# Altium schematic sheet PowerAmp.SchDoc
size A
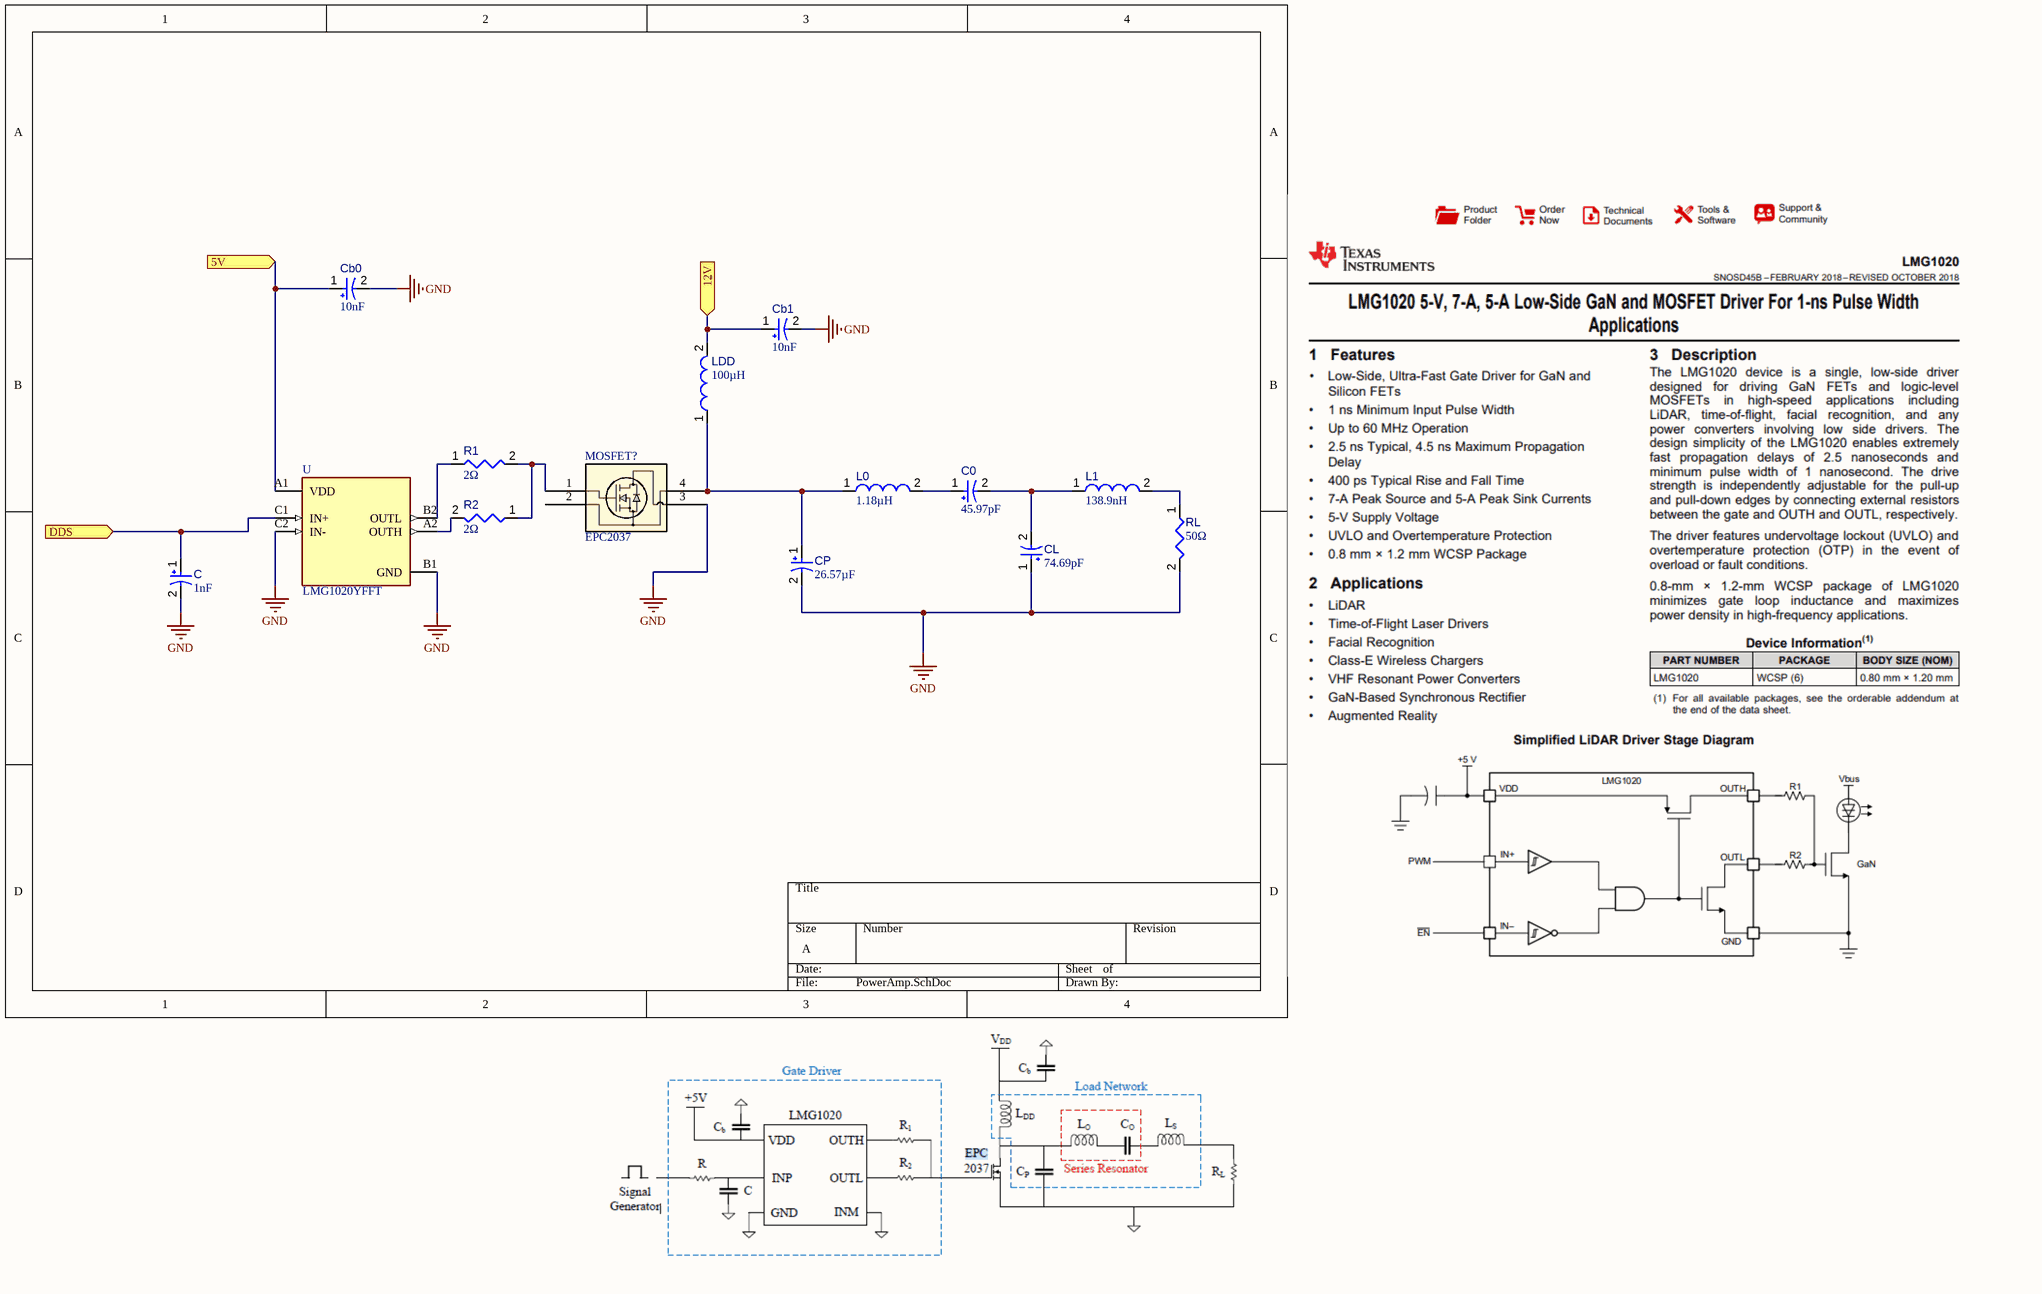
[diagram p0: PowerAmp.SchDoc]

## Parts
C  value 1nF  [CAPPR55-250-1120X630X1220]  (hidden comment: ECA1HM470)
C0  value 45.97pF  [CAPPR55-250-1120X630X1220]  (hidden comment: ECA1HM470)
Cb0  value 10nF  [CAPPR55-250-1120X630X1220]  (hidden comment: ECA1HM470)
Cb1  value 10nF  [CAPPR55-250-1120X630X1220]  (hidden comment: ECA1HM470)
CL  value 74.69pF  [CAPPR55-250-1120X630X1220]  (hidden comment: ECA1HM470)
CP  value 26.57µF  [CAPPR55-250-1120X630X1220]  (hidden comment: ECA1HM470)
L0  value 1.18µH  [INDC2520X120X60NL20T20]  (hidden comment: LQM2HPN1R0MJ0L)
L1  value 138.9nH  [INDC2520X120X60NL20T20]  (hidden comment: LQM2HPN1R0MJ0L)
LDD  value 100µH  [INDC2520X120X60NL20T20]  (hidden comment: LQM2HPN1R0MJ0L)
MOSFET?  EPC2037  [DIE4_0P9X0P9_ECC]
R1  value 2Ω  [RESC0402(1005)_L]  (hidden comment: 0R2J)
R2  value 2Ω  [RESC0402(1005)_L]  (hidden comment: 0R2J)
RL  value 50Ω  [RESC0402(1005)_L]  (hidden comment: 0R2J)
U  LMG1020YFFT  [BGA6N40P3X2_125X85X62N]

## Ports
5V (in), 12V (in), DDS (in)

## Nets
GND: C.2 Cb0.2 Cb1.2 CL.1 CP.2 MOSFET?.3 RL.2 U.B1(GND) U.C2(IN-)
5V: Cb0.1 U.A1(VDD) ; port 5V
12V: Cb1.1 LDD.2 ; port 12V
DDS: C.1 U.C1(IN+) ; port DDS
NetC0_1: C0.1 L0.2
NetC0_2: C0.2 CL.2 L1.1
NetCP_1: CP.1 L0.1 LDD.1 MOSFET?.4
NetL1_2: L1.2 RL.1
NetMOSFET?_1: MOSFET?.1 R1.2 R2.1
NetR1_1: R1.1 U.B2(OUTL)
NetR2_2: R2.2 U.A2(OUTH)

Not connected (* = marked no-connect by the designer): MOSFET? 2

## Library data of the parts
C C0 Cb0 Cb1 CL CP = CMP-001-00030-7: Aluminum Electrolytic Capacitor, 47 uF, +/- 20%, 50 V, -40 to 85 degC, 2-Pin THD, RoHS, Bulk; Manufacturer: Panasonic; Voltage Rating: 50V; Ripple Current: 130mA; Package Reference: CAPPR55-250-1120X630X1220; Packaging: Bulk; Case/Package: Radial; Pins: 2; Package Description: 2-Pin Radial Lead, Dia 6.3 mm, Height 12.2 mm; Capacitor Type: Electrolytic; Max Operating Temperature: 85°C; Min Operating Temperature: -40°C; Datasheet Version: Rev. 05, 10/2016; Manufacturer URL: http://www.panasonic.com/; RoHS Compliant: True; Lead Pitch: 2.5mm; Package Quantity: 200; Mounting Technology: TH; Ripple Current (AC): 130mA; Datasheet URL: https://industrial.panasonic.com/cdbs/www-data/pdf/RDF0000/ABA0000C1218.pdf; Tolerance: 20%; Diameter: 6.3mm
L0 L1 LDD = CMP-006-00008-6: Chip Inductor, 1 uH, +/- 20%, 1 MHz, -55 to 125 degC, 1008 (2520 Metric), RoHS, Tape and Reel; Manufacturer: Murata; Self Resonant Frequency: 70MHz; Current Rating: 1.5A; Shielding: Shielded; Core Material: Ferrite; Resistance: 0.09Ohm; Datasheet URL: http://psearch.en.murata.com/inductor/product/LQM2HPN1R0MJ0%23.pdf; Datasheet Version: Aug-16; RoHS Compliant: True; Case/Package: 1008; Package Description: 2-Pin Surface Mount Device, Body 2.5 x 2 mm; Package Quantity: 3000; Tolerance: 20%; Min Operating Temperature: -40°C; Package Reference: 1008; Packaging: TapeandReel; Mounting Technology: SM; Max Operating Temperature: 85°C
MOSFET? = EPC2037: Description; Manufacturer_Name: EPC; Copyright: Copyright (C) 2025 Ultra Librarian. All rights reserved.; Manufacturer_Part_Number: EPC2037; RefDes: RefDes; Type: Type
R1 R2 RL = CMP-009-00062-2: Jumper 0402 (1005 Metric); Pins: 2; Mounting Technology: SMT; Case/Package: 0402
U = LMG1020YFFT: 5V, 7A/5A low side GaN driver with 60MHz/1ns speed 6-DSBGA -40 to 125; MF: Texas Instruments; DigiKey-Purchase-URL: https://snapeda.com/shop?store=DigiKey&id=3077628; Mouser-Purchase-URL: https://snapeda.com/shop?store=Mouser&id=3077628; SnapEDA_Link: https://www.snapeda.com/parts/LMG1020YFFT/Texas%20Instruments/view-part/3077628/?ref=snap; Digi-Key_Part_Number: 296-50209-1-ND; MP: LMG1020YFFT; Value: *; Arrow_Asia-Purchase-URL: https://snapeda.com/shop?store=Arrow+Asia&id=3077628; Texas_Instruments-Purchase-URL: https://snapeda.com/shop?store=Texas+Instruments&id=3077628; Package: DSBGA-6 Texas Instruments; Check_prices: https://www.snapeda.com/parts/LMG1020YFFT/Texas%20Instruments/view-part/3077628/?ref=eda